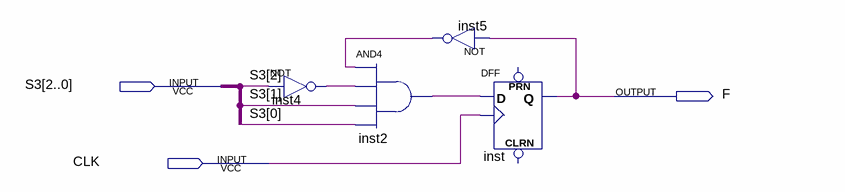
[diagram p0: schematic sheet]
// Quartus schematic FS3.bdf as structural Verilog: 4 symbols, 3 pins
module FS3 (
  input  [2:0] S3,
  input  CLK,
  output F
);

  wire inst2_out, inst4_out, inst5_out;

  not inst4 (inst4_out, S3[2]);
  and inst2 (inst2_out, inst5_out, inst4_out, S3[1], S3[0]);
  not inst5 (inst5_out, F);
  DFF inst (.CLK(CLK), .D(inst2_out), .Q(F));  // open: CLRN, PRN
endmodule
